# Altium schematic sheet 09_USB.SchDoc
size A3
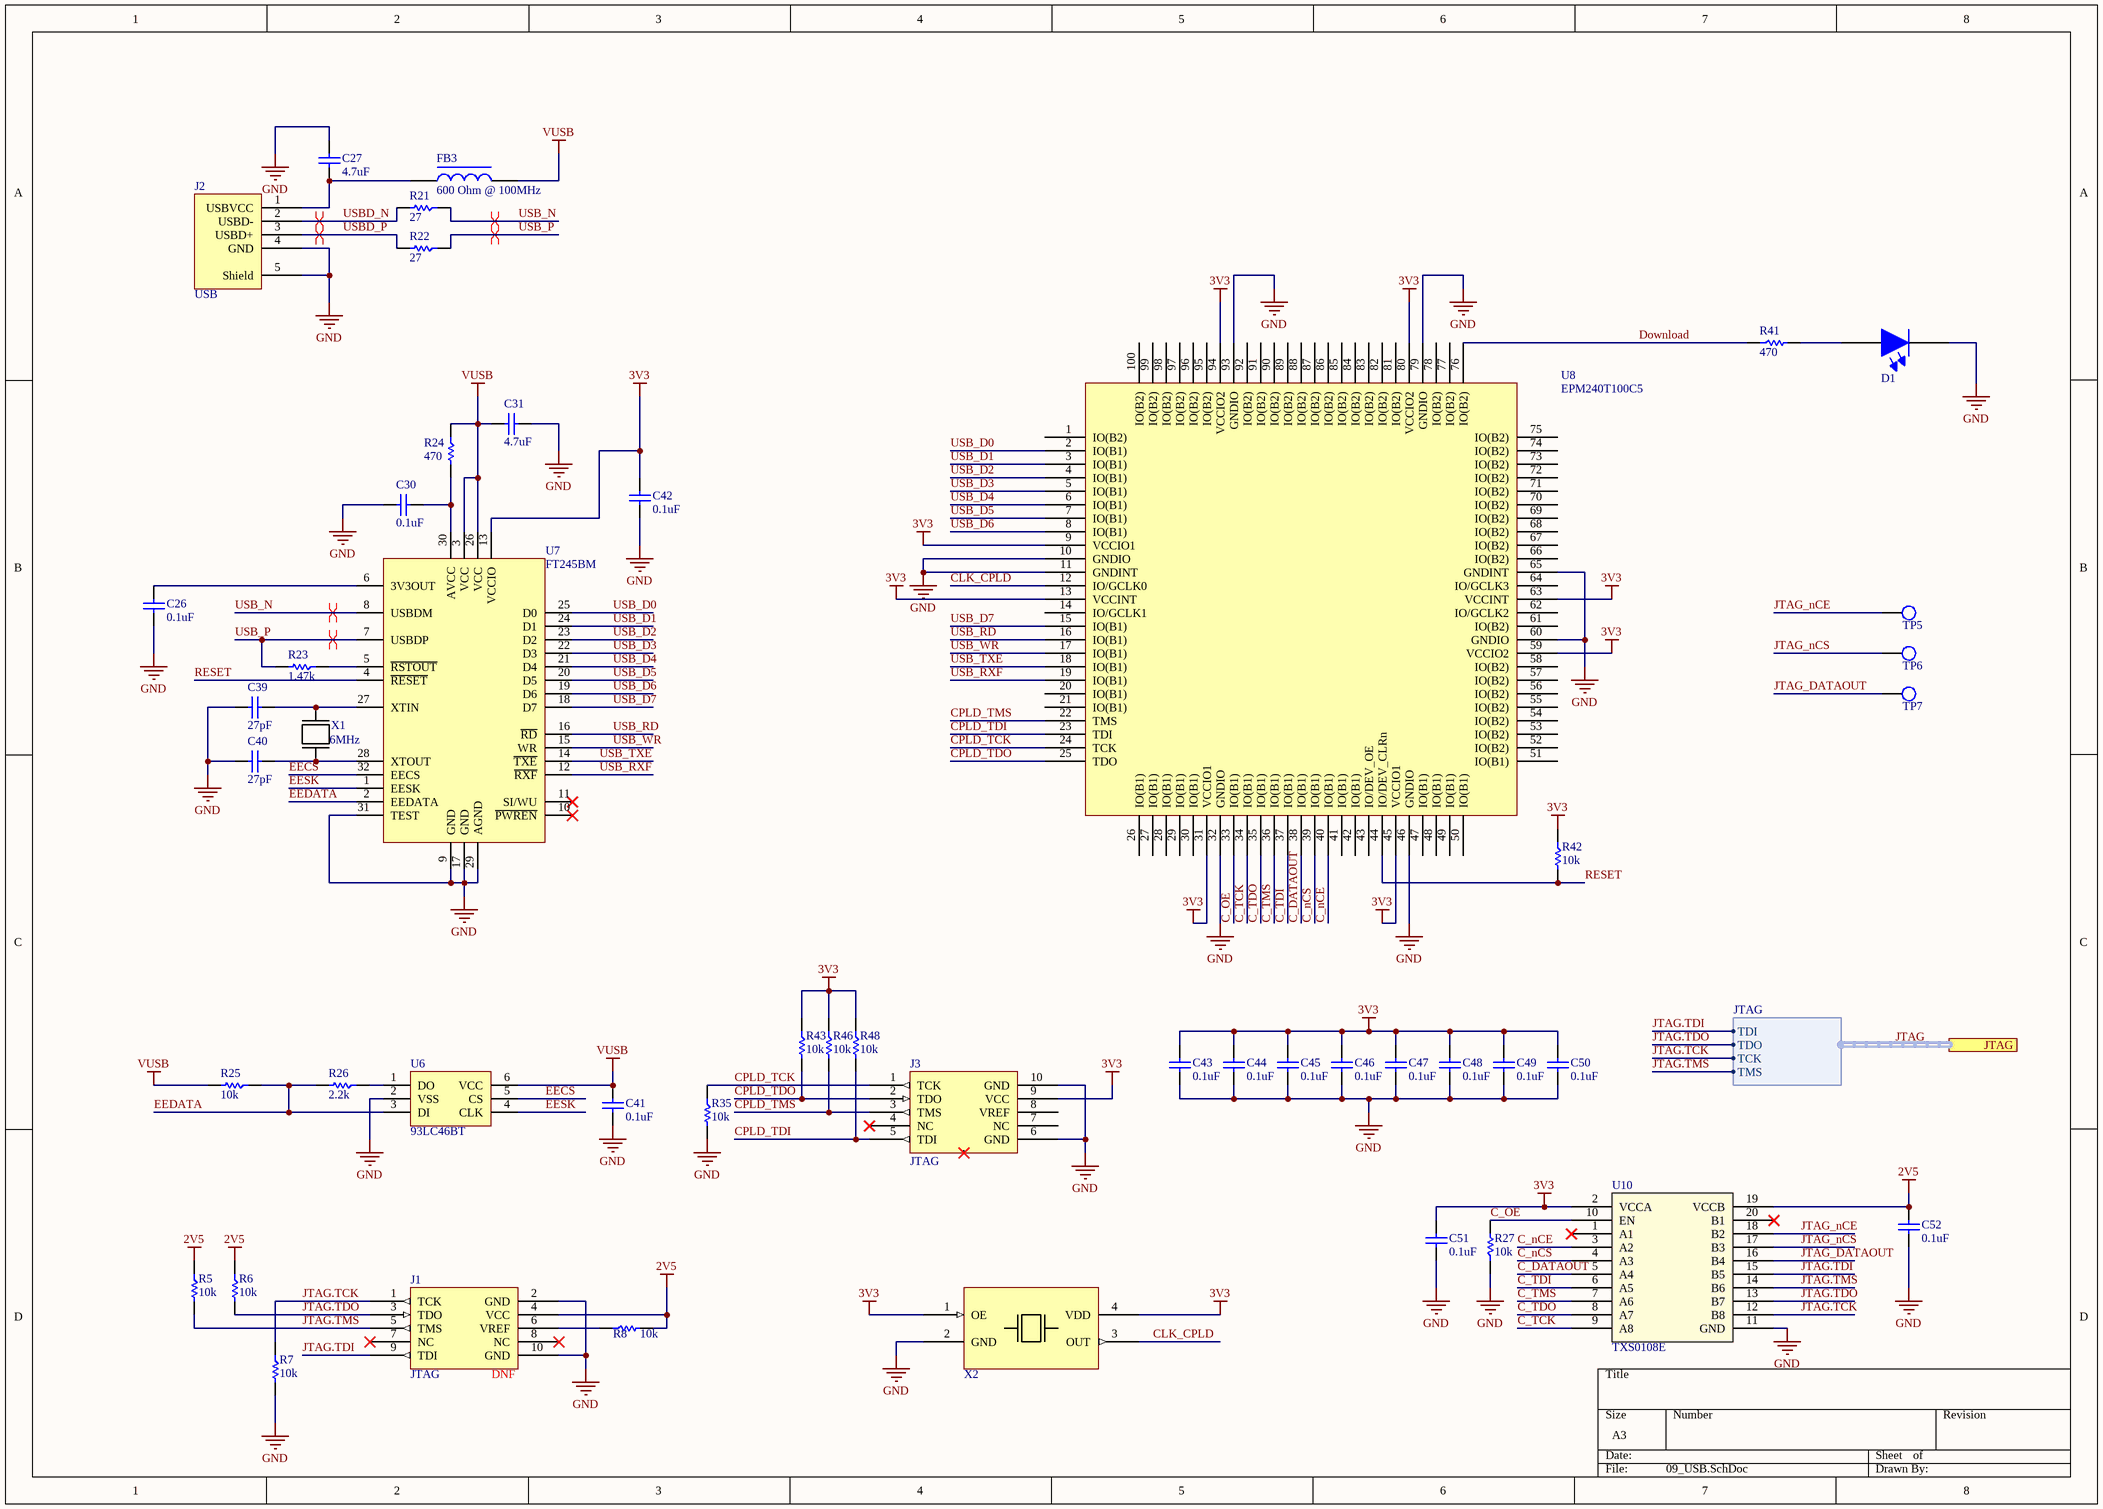
[diagram p0: 09_USB.SchDoc]

## Parts
C26  0.1uF  [CAP0402R]
C27  4.7uF  [CAP0805R]
C30  0.1uF  [CAP0402R]
C31  4.7uF  [CAP0805R]
C39  27pF  [CAP0402R]
C40  27pF  [CAP0402R]
C41  0.1uF  [CAP0402R]
C42  0.1uF  [CAP0402R]
C43  0.1uF  [CAP0402R]
C44  0.1uF  [CAP0402R]
C45  0.1uF  [CAP0402R]
C46  0.1uF  [CAP0402R]
C47  0.1uF  [CAP0402R]
C48  0.1uF  [CAP0402R]
C49  0.1uF  [CAP0402R]
C50  0.1uF  [CAP0402R]
C51  0.1uF  [CAP0402R]
C52  0.1uF  [CAP0402R]
D1  LED  [0805D-RED]  (value not drawn)
FB3  600 Ohm @ 100MHz  [RES0805R]
J1  JTAG  Load: DNF  [BOXEDVERT10]  (no BOM)
J2  USB  [USBPLUG]
J3  JTAG  [TC2050-IDC-NL]  (no BOM)
R5  10k  [RES0603R]
R6  10k  [RES0603R]
R7  10k  [RES0603R]
R8  10k  [RES0603R]
R21  27  [RES0402R]
R22  27  [RES0402R]
R23  1.47k  [RES0402R]
R24  470  [RES0402R]
R25  10k  [RES0603R]
R26  2.2k  [RES0603R]
R27  10k  [RES0603R]
R35  10k  [RES0603R]
R41  470  [RES0402R]
R42  10k  [RES0603R]
R43  10k  [RES0603R]
R46  10k  [RES0603R]
R48  10k  [RES0603R]
TP5  TestPoint  [TestPoint]  (value not drawn)  (no BOM)
TP6  TestPoint  [TestPoint]  (value not drawn)  (no BOM)
TP7  TestPoint  [TestPoint]  (value not drawn)  (no BOM)
U6  93LC46BT  [SOT23-6]
U7  FT245BM  [LQFP32]
U8  EPM240T100C5  [TQFP100-14mm]
U10  TXS0108E  [TSSOP20-4.4mm]
X1  6MHz  [HC-49/US]
X2  24Mhz Oscillator  [CX32225SB]  (value not drawn)

## Ports
JTAG (harness JTAG)

## Harnesses
JTAG: TDI, TDO, TCK, TMS

## Nets
2V5: C52.1 J1.4(VCC) R5.1 R6.1 R8.2 U10.19(VCCB)
3V3: C42.2 C43.1 C44.1 C45.1 C46.1 C47.1 C48.1 C49.1 C50.1 C51.1 J3.9(VCC) R42.1 R43.1 R46.1 R48.1 U7.13(VCCIO) U8.9(VCCIO1) U8.13(VCCINT) U8.31(VCCIO1) U8.45(VCCIO1) U8.59(VCCIO2) U8.63(VCCINT) U8.80(VCCIO2) U8.94(VCCIO2) U10.2(VCCA) X2.1(OE) X2.4(VDD)
GND: C26.2 C27.1 C30.1 C31.2 C39.1 C40.1 C41.1 C42.1 C43.2 C44.2 C45.2 C46.2 C47.2 C48.2 C49.2 C50.2 C51.2 C52.2 D1.K(CATHODE) J1.2(GND) J1.10(GND) J2.4(GND) J2.5(Shield) J3.6(GND) J3.10(GND) R7.2 R27.1 R35.2 U6.2(VSS) U7.9(GND) U7.17(GND) U7.29(AGND) U7.31(TEST) U8.10(GNDIO) U8.11(GNDINT) U8.32(GNDIO) U8.46(GNDIO) U8.60(GNDIO) U8.65(GNDINT) U8.79(GNDIO) U8.93(GNDIO) U10.11(GND) X2.2(GND)
VUSB: C31.1 C41.2 FB3.2 R24.1 R25.2 U6.6(VCC) U7.3(VCC) U7.26(VCC)
C_DATAOUT: U8.38(IO(B1)) U10.5(A4)
C_nCE: U8.40(IO(B1)) U10.3(A2)
C_nCS: U8.39(IO(B1)) U10.4(A3)
C_OE: R27.2 U8.33(IO(B1)) U10.10(EN)
C_TCK: U8.34(IO(B1)) U10.9(A8)
C_TDI: U8.37(IO(B1)) U10.6(A5)
C_TDO: U8.35(IO(B1)) U10.8(A7)
C_TMS: U8.36(IO(B1)) U10.7(A6)
CLK_CPLD: U8.12(IO/GCLK0) X2.3(OUT)
CPLD_TCK: J3.1(TCK) R35.1 U8.24(TCK)
CPLD_TDI: J3.5(TDI) R48.2 U8.23(TDI)
CPLD_TDO: J3.2(TDO) R43.2 U8.25(TDO)
CPLD_TMS: J3.3(TMS) R46.2 U8.22(TMS)
Download: R41.1 U8.76(IO(B2))
EECS: U6.5(CS) U7.32(EECS)
EEDATA: R25.1 R26.2 U6.3(DI) U7.2(EEDATA)
EESK: U6.4(CLK) U7.1(EESK)
JTAG.TCK: J1.1(TCK) R7.1 U10.12(B8) ; port JTAG.TCK
JTAG.TDI: J1.9(TDI) U10.15(B5) ; port JTAG.TDI
JTAG.TDO: J1.3(TDO) R6.2 U10.13(B7) ; port JTAG.TDO
JTAG.TMS: J1.5(TMS) R5.2 U10.14(B6) ; port JTAG.TMS
JTAG_DATAOUT: TP7.0(TP) U10.16(B4)
JTAG_nCE: TP5.0(TP) U10.18(B2)
JTAG_nCS: TP6.0(TP) U10.17(B3)
RESET: R42.2 U7.4(~{RESET}) U8.44(IO/DEV_CLRn)
USB_D0: U7.25(D0) U8.2(IO(B1))
USB_D1: U7.24(D1) U8.3(IO(B1))
USB_D2: U7.23(D2) U8.4(IO(B1))
USB_D3: U7.22(D3) U8.5(IO(B1))
USB_D4: U7.21(D4) U8.6(IO(B1))
USB_D5: U7.20(D5) U8.7(IO(B1))
USB_D6: U7.19(D6) U8.8(IO(B1))
USB_D7: U7.18(D7) U8.15(IO(B1))
USB_N: R21.1 U7.8(USBDM)
USB_P: R22.1 R23.2 U7.7(USBDP)
USB_RD: U7.16(~{RD}) U8.16(IO(B1))
USB_RXF: U7.12(~{RXF}) U8.19(IO(B1))
USB_TXE: U7.14(~{TXE}) U8.18(IO(B1))
USB_WR: U7.15(WR) U8.17(IO(B1))
USBD_N: J2.2(USBD-) R21.2
USBD_P: J2.3(USBD+) R22.2
NetC26_1: C26.1 U7.6(3V3OUT)
NetC27_2: C27.2 FB3.1 J2.1(USBVCC)
NetC30_2: C30.2 R24.2 U7.30(AVCC)
NetC39_2: C39.2 U7.27(XTIN) X1.1
NetC40_2: C40.2 U7.28(XTOUT) X1.2
NetD1_A: D1.A(ANODE) R41.2
NetJ1_6: J1.6(VREF) R8.1
NetR23_1: R23.1 U7.5(~{RSTOUT})
NetR26_1: R26.1 U6.1(DO)

Not connected (* = marked no-connect by the designer): J1 7(NC)* 8(NC)*; J3 0* 4(NC)* 7(NC) 8(VREF); U7 10(~{PWREN})* 11(SI/WU)*; U8 1(IO(B2)) 14(IO/GCLK1) 20(IO(B1)) 21(IO(B1)) 26(IO(B1)) 27(IO(B1)) 28(IO(B1)) 29(IO(B1)) 30(IO(B1)) 41(IO(B1)) 42(IO(B1)) 43(IO/DEV_OE) 47(IO(B1)) 48(IO(B1)) 49(IO(B1)) 50(IO(B1)) 51(IO(B1)) 52(IO(B2)) 53(IO(B2)) 54(IO(B2)) 55(IO(B2)) 56(IO(B2)) 57(IO(B2)) 58(IO(B2)) 61(IO(B2)) 62(IO/GCLK2) 64(IO/GCLK3) 66(IO(B2)) 67(IO(B2)) 68(IO(B2)) 69(IO(B2)) 70(IO(B2)) 71(IO(B2)) 72(IO(B2)) 73(IO(B2)) 74(IO(B2)) 75(IO(B2)) 77(IO(B2)) 78(IO(B2)) 81(IO(B2)) 82(IO(B2)) 83(IO(B2)) 84(IO(B2)) 85(IO(B2)) 86(IO(B2)) 87(IO(B2)) 88(IO(B2)) 89(IO(B2)) 90(IO(B2)) 91(IO(B2)) 92(IO(B2)) 95(IO(B2)) 96(IO(B2)) 97(IO(B2)) 98(IO(B2)) 99(IO(B2)) 100(IO(B2)); U10 1(A1)* 20(B1)*

## Buses and harness runs
harness JTAG = port JTAG

## Layout directives
differential pair: USB_N, USB_P, USBD_N, USBD_P

## Library data of the parts
C26 C27 C30 C31 C39-C52 = C: Capacitor; Class I: Passive; Load: YES; Revision: July-2002: Re-released for DXP Platform.; Supplier 1: Digi-Key; Mount: SMD
  C26 C41: Supplier Part Number 1: 311-3560-1-ND; Value: 0.1uF
  C27: Supplier Part Number 1: 445-14527-2-ND; Value: 4.7uF
  C30 C42-C52: Supplier Part Number 1: 1276-1057-1-ND; Value: 0.1uF
  C31: Supplier Part Number 1: 445-6859-1-ND; Value: 4.7uF
  C39 C40: Supplier Part Number 1: 445-5589-1-ND; Value: 27pF
D1 = LED_SMD_Generic: Generic LED; 01 Created By: Thomas Harper; 02 Reviewed By: Rodrigo Maureira @ 2018-04-05; Load: YES; Published: 12-Mar-2018; Publisher: MUEEC; Supplier 1: Digi-Key; Supplier Part Number 1: 732-4982-1-ND; Mount: SMD
FB3 = Ferrite_Bead: Ferrite Bead; Load: YES; Supplier 1: Digi-Key; Supplier Part Number 1: 445-172908-1-ND; Value: 600 Ohm @ 100MHz; Mount: SMD
J1 = JTAG_CON: JTAG connector; Supplier 1: Digi-Key; Supplier Part Number 1: ED1543-ND
J2 = USBPLUG: USB B Type Connector; Load: YES; Supplier 1: Digi-Key; Supplier Part Number 1: AE11183-ND; Mount: T/H
J3 = JTAG_CON_POGO: Contacts for TC2050-IDC-NL; 01 Created By: Rodrigo Maureira; Load: YES; Published: 18-Jun-2018; Publisher: MUEEC; Supplier 1: Digi-Key; Supplier Part Number 1: TC2050-IDC-NL-430-ND
R5-R8 R21-R27 R35 R41-R43 R46 R48 = R: Resistor; Load: YES; Mount: SMD; Supplier 1: Digi-Key
  R5-R8 R25 R27 R35 R42 R43 R46 R48: Supplier Part Number 1: 311-10.0KHRCT-ND; Value: 10k
  R21 R22: Supplier Part Number 1: YAG3086CT-ND; Value: 27
  R23: Supplier Part Number 1: YAG3038CT-ND; Value: 1.47k
  R24 R41: Supplier Part Number 1: 311-470LRCT-ND; Value: 470
  R26: Supplier Part Number 1: P2.20KLCT-ND; Value: 2.2k
TP5-TP7 = TestPoint: Test Point; Load: YES
U6 = FM93C46: 1024-Bit Serial CMOS EEPROM; Load: YES; Supplier 1: Digi-Key; Supplier Part Number 1: 93LC46BT-I/OTCT-ND; Mount: SMD
U7 = FT245BM: USB FIFO IC; Load: YES; Supplier 1: Digi-Key; Supplier Part Number 1: 768-1308-ND; Mount: SMD
U8 = EPM240T100C5: Load: YES; Supplier 1: Digi-Key; Supplier Part Number 1: 544-1964-ND; Mount: SMD
U10 = TXS0108E: 8-BIT BIDIRECTIONAL VOLTAGE-LEVEL TRANSLATOR  FOR OPEN-DRAIN AND PUSH-PULL APPLICATIONS; Load: YES; Supplier 1: Digi-Key; Supplier Part Number 1: 296-23011-1-ND; Mount: SMD
X1 = Crystal 6MHz: ECS-60-20-5PX-TR; Load: YES; Supplier Part Number 1: XC1000DKR-ND; Supplier 1: Digi-Key; Mount: SMD
X2 = 24Mhz Oscillator: 01 Created By: Rodrigo Maureira; Load: YES; Published: 18-Jun-2018; Publisher: MUEEC; Supplier 1: Digi-Key; Supplier Part Number 1: DSC6101CI1A-024.0000-ND; Mount: SMD